# EAGLE design usb-isolator (EAGLE 7.7.0)
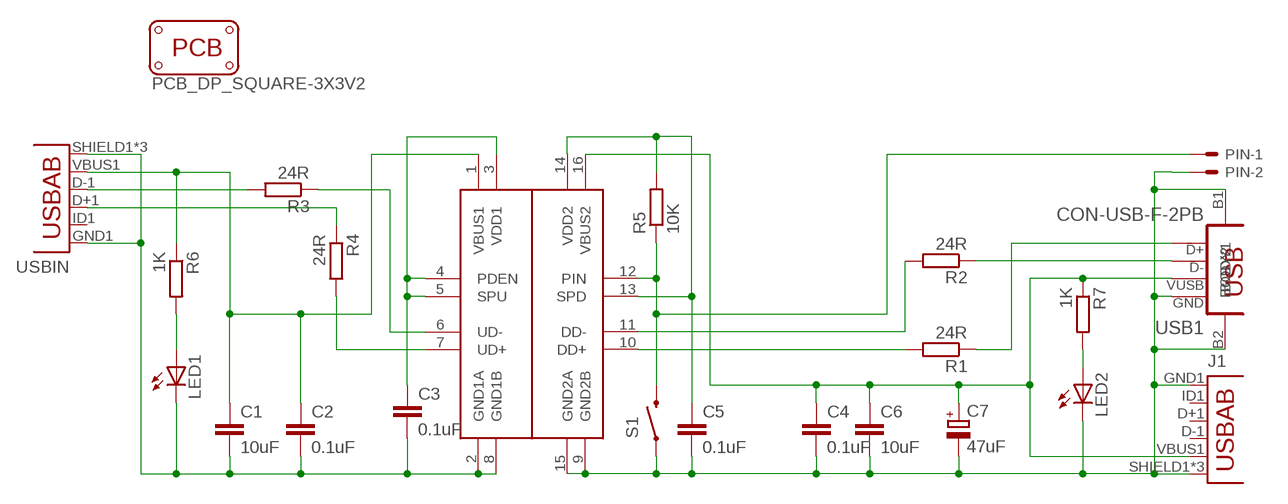
[diagram p0: schematic, sheet 1]

## Parts
C1  10uF  C-EUC0805K  [C0805K]
C2  0.1uF  C-EUC0603K  [C0603K]
C3  0.1uF  C-EUC0603K  [C0603K]
C4  0.1uF  C-EUC0603K  [C0603K]
C5  0.1uF  C-EUC0603K  [C0603K]
C6  10uF  C-EUC0805K  [C0805K]
C7  47uF  CPOL-EUD/7343-31W  [D/7343-31W]
IC1  ADUM3160BRWZ  [SO16W]
J1  USB-ABCONN-11794  [USB-AB-MICRO-SMD_V03]
LED1  LED-0805  [LED-805]
LED2  LED-0805  [LED-805]
PIN  22-23-2021  [22-23-2021]
R1  24R  R-EU_R0603  [R0603]
R2  24R  R-EU_R0603  [R0603]
R3  24R  R-EU_R0603  [R0603]
R4  24R  R-EU_R0603  [R0603]
R5  10K  R-EU_R0603  [R0603]
R6  1K  R-EU_R0603  [R0603]
R7  1K  R-EU_R0603  [R0603]
S1  SWITCH-MOMENTARY-2SMD-1101NE  [TACTILE-SWITCH-1101NE]
USB1  CON-USB-F-2PB  [CONN_USB_A_F]
USB-ISOLATOR  PCB_DP_SQUARE-3X3V2  [DP3030_V2]
USBIN  USB-ABCONN-11794  [USB-AB-MICRO-SMD_V03]

## Nets
DD_N [differential]: R2.1 USB1.2(D-)
DD_P [differential]: R1.1 USB1.3(D+)
GND1: C1.2 C2.2 C3.2 IC1.2(GND1A) IC1.8(GND1B) LED1.C USBIN.GND1(GND) USBIN.SHIELD1(SHIELD) USBIN.SHIELD2(SHIELD) USBIN.SHIELD3(SHIELD)
GND2: C4.2 C5.2 C6.2 C7.- IC1.9(GND2B) IC1.15(GND2A) J1.GND1(GND) J1.SHIELD1(SHIELD) J1.SHIELD2(SHIELD) J1.SHIELD3(SHIELD) LED2.C PIN.2 S1.1 USB1.4(GND) USB1.B1(BODY1) USB1.B2(BODY2)
N$12: LED1.A R6.2
N$13: LED2.A R7.2
PIN: IC1.12(PIN) PIN.1 R5.1 S1.2
R_DD_N [differential]: IC1.11(DD-) R2.2
R_DD_P [differential]: IC1.10(DD+) R1.2
R_UD_N [differential]: IC1.6(UD-) R3.1
R_UD_P [differential]: IC1.7(UD+) R4.2
UD_N [differential]: R4.1 USBIN.D+1(D+)
UD_P [differential]: R3.2 USBIN.D-1(D-)
VBUS1: C1.1 C2.1 IC1.1(VBUS1) R6.1 USBIN.VBUS1(VBUS)
VBUS2: C4.1 C6.1 C7.+ IC1.16(VBUS2) J1.VBUS1(VBUS) R7.1 USB1.1(VUSB)
VDD1: C3.1 IC1.3(VDD1) IC1.4(PDEN) IC1.5(SPU)
VDD2: C5.1 IC1.13(SPD) IC1.14(VDD2) R5.2
Unconnected: J1.D+1(D+) J1.D-1(D-) J1.ID1(USBID) USBIN.ID1(USBID)

## Library data of the parts
C1-C6 = rcl:C-EU: CAPACITOR, European symbol
C7 = rcl:CPOL-EU: POLARIZED CAPACITOR, European symbol
IC1 = semiconductors:ADUM3160
J1 USBIN = SparkFun-Connectors:USB-AB: This is a USB AB connector that is compatible with USB OTG. i.e. this connector can serve as a host or device; PROD_ID: CONN-11794
LED1 LED2 = semiconductors:LED: Light Emitting Diode
PIN = con-molex:22-23-2021: .100" (2.54mm) Center Header - 2 Pin; MF: MOLEX; MPN: 22-23-2021; OC_FARNELL: 1462926; OC_NEWARK: 25C3832
R1-R7 = resistor:R-EU_: RESISTOR, European symbol
S1 = SparkFun-Electromechanical:SWITCH-MOMENTARY-2: Various NO switches- pushbuttons, reed, etc; PROD_ID: SWCH-00815
USB1 = mechanical:CON-USB-F-2PB: USB Female connector with 2 body pins
USB-ISOLATOR = mechanical:PCB_DP_SQUARE: Dangerous Prototypes Standard Square PCB sizes (5050 is 49.9x49.9 for panelisation)

## Net classes
1 differential: width 0.25 mm, drill 0.305 mm, clearance 0.25 mm
2 isolated: width 0.25 mm, clearance 1 mm

## Board
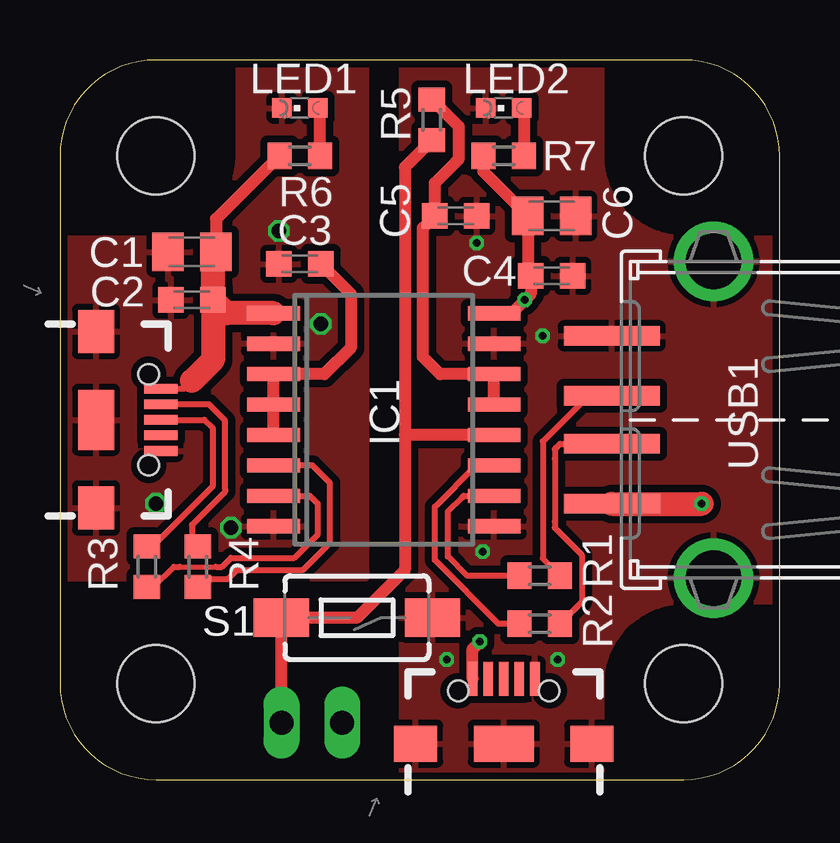
[diagram p1: board, top side]
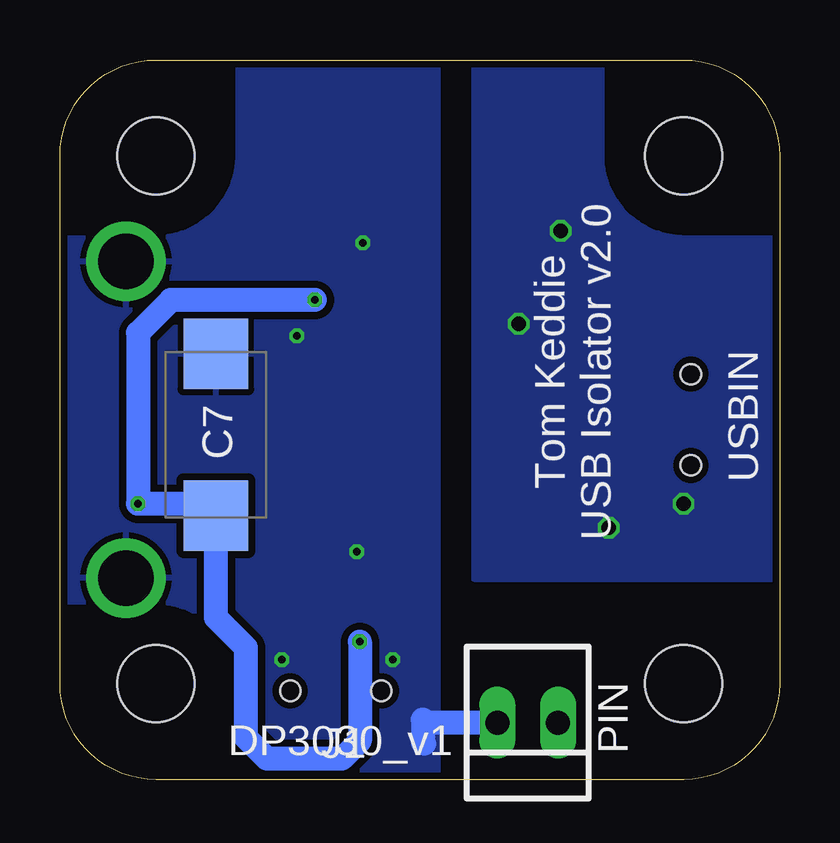
[diagram p2: board, bottom side, seen from below]

Size 30 x 30 mm. Coordinates in mm from the lower left corner, seen from the top.
Copper layers (1*16): Top 0.035mm / dielectric 1.5mm / Bottom 0.035mm
Design rules "ITEADstudio_DRC": minimum track width 6mil, minimum drill 12mil, track to track 6mil, track to pad 6mil, pad to pad 6mil, via to via 6mil, smd to smd 0mil, copper to edge 10mil, drill to drill 10mil, minimum pad ring 10mil, minimum via ring 6mil, stop-mask expansion 2mil, vias tented up to drill 100mil, thermal gap 10mil

### Footprints (pad centres in the part's own frame; a part is rotated, then mirrored left to right if it is on the bottom)
C0805K = smd 1.3 x 1.6: 1 -1,0; 2 1,0
C0603K = smd 1.05 x 1.08: 1 -0.875,0; 2 0.875,0
D/7343-31W = smd 2.95 x 2.7: + 3.375,0; - -3.375,0
SO16W = smd 0.6 x 2.2: 1 -4.445,-4.6; 2 -3.175,-4.6; 3 -1.905,-4.6; 4 -0.635,-4.6; 5 0.635,-4.6; 6 1.905,-4.6; 7 3.175,-4.6; 8 4.445,-4.6; 9 4.445,4.6; 10 3.175,4.6; 11 1.905,4.6; 12 0.635,4.6; 13 -0.635,4.6; 14 -1.905,4.6; 15 -3.175,4.6; 16 -4.445,4.6
USB-AB-MICRO-SMD_V03 = smd 1.4 x 0.4: D+1 2.7,0; D-1 2.7,0.65; GND1 2.7,-1.3; ID1 2.7,-0.65; VBUS1 2.7,1.3 | smd 1.5 x 1.8: SHIELD1 0,3.68; SHIELD3 0,-3.68 | smd 1.5 x 2.5: SHIELD2 0,0 | hole 0.85: 2.2,1.9; 2.2,-1.9
LED-603 = smd 0.8 x 0.8: A 0,-0.75; C 0,0.75
22-23-2021 = drill 1 long: 1 -1.27,0; 2 1.27,0
R0603 = smd 1 x 1.1: 1 -0.85,0; 2 0.85,0
TACTILE-SWITCH-1101NE = smd 2.3 x 1.6: 1 -3.15,0; 2 3.15,0
CONN_USB_A_F = smd 0.8 x 4: 1 -3.5,7; 2 -1,7; 3 1,7; 4 3.5,7 | drill 2.3: B1 -6.6,2.75; B2 6.6,2.75
DP3030_V1 = hole 3.2: 4,4; 26,4; 26,26; 4,26

### Placement (x,y rotation side)
C1  5.5,22 180 top
C2  5.5,20 180 top
C3  10,21.5 180 top
C4  20.5,21 0 top
C5  16.5,23.5 0 top
C6  20.5,23.5 0 top
C7  23.5,14.38 270 bottom
IC1  13.5,15 270 top
J1  18.5,1.5 90 top
LED1  [LED-603]  10,28 90 top
LED2  [LED-603]  18.5,28 90 top
PIN  10.5,2.38 180 bottom
R1  20,8.5 180 top
R2  20,6.5 180 top
R3  5.75,8.88 90 top
R4  3.62,8.88 270 top
R5  15.5,27.5 90 top
R6  10,26 0 top
R7  18.5,26 0 top
S1  12.38,6.75 180 top
USB1  30,15 90 top
USB-ISOLATOR  PCB_DP_SQUARE-3X3  [DP3030_V1]  0,0 0 top
USBIN  1.5,15 0 top

### Tracks (layer width: path | path; a pad name or v marks a point on that pad's centre or on a via)
DD_N
  Top 0.25: R2.1 21.75,7.4 21.75,9.38 20.62,10.5 20.62,10.75 20.62,13.38 20.62,13.77 20.68,13.82 20.85,14 USB1.2
DD_P
  Top 0.25: R1.1 20.12,9.22 20.12,14.1 22.02,16 USB1.3
GND1  (via drill 0.6)
  other vias: 4,11.5 7.12,10.5 10.88,19 9.12,22.88
  pour Top (isolate 0.305): 0,30 12.75,30 12.75,8.38 0,8.38
  pour Bottom (isolate 0.305): 0,30 12.75,30 12.75,8.38 0.12,8.38
GND2  (via drill 0.3)
  Bottom 1: PIN.2 14.75,2.38 14.88,2.5 14.88,1.55 J1.SHIELD1
  other vias: 17.62,9.5 20.75,5 16.12,5 20.12,18.5 17.38,22.38
  pour Top (isolate 0.305): 14.25,30 30,30 30,0 14.25,0
  pour Bottom (isolate 0.305): 14.25,30 30,30 30,0 14.25,0
N$12
  Top 0.5: R6.2 10.85,27.9 LED1.A
N$13
  Top 0.5: LED2.A 19.35,27.9 R7.2
PIN
  Top 0.5: R5.1 14.38,25.52 14.38,14.38 | 14.38,14.38 14.38,8.75 12.38,6.75 S1.2 9.23,6.5 PIN.1 | IC1.12 14.38,14.38
R_DD_N
  Top 0.25: R2.2 18.27,6.5 15.62,9.15 15.62,11.38 17.34,13.1 IC1.11
R_DD_P
  Top 0.25: R1.2 16.98,8.5 16.18,9.3 16.18,11.18 16.75,11.75 16.82,11.82 IC1.10
R_UD_N
  Top 0.25: R3.1 5.78,8.03 6.12,8.38 7,8.38 7.38,8.75 10.12,8.75 11.25,9.88 11.25,12.38 10.53,13.1 IC1.6
R_UD_P
  Top 0.2: 5,8.88 6.5,8.88
  Top 0.25: R4.2 3.9,8.03 4.75,8.88 5,8.88 | 6.5,8.88 6.75,8.88 7.12,9.25 9.77,9.25 10.75,10.23 10.75,11.5 10.43,11.82 IC1.7
UD_N
  Top 0.25: USBIN.D+1 6.02,15 6.38,14.65 6.38,12.25 3.88,9.75 3.65,9.75 R4.1
UD_P
  Top 0.25: USBIN.D-1 6.2,15.65 6.88,14.98 6.88,12.12 6.88,12 5.5,10.62 5.5,9.85 R3.2
VBUS1
  Top 0.25: USBIN.VBUS1 5.17,16.3 5.5,16.62
  Top 0.5: R6.1 9.12,26 6.5,23.38 C1.1
  Top 1: IC1.1 6.93,19.45 C2.1 | C2.1 6.38,17.5 5.5,16.62 | C2.1 6.38,21.88 C1.1
VBUS2  (via drill 0.3)
  Top 0.5: R7.1 17.65,25.35 C6.1 19.5,21.12 C4.1 19.62,20.25 v19.38,20 18.88,19.5 18.16,19.5 IC1.16 | J1.VBUS1 17.2,5.45 v17.5,5.75
  Top 1: USB1.1 v26.75,11.5
  Bottom 1: v17.5,5.75 17.5,1.62 18.25,0.88 21.38,0.88 22.25,1.75 22.25,5.5 23.5,6.75 C7.+ 24,11.5 v26.75,11.5 26.75,18.62 25.38,20 v19.38,20
VDD1
  Top 0.5: IC1.5 IC1.4 IC1.3 11.03,16.91 12.12,18 12.12,20.25 C3.1
VDD2
  Top 0.5: IC1.13 IC1.14 15.85,16.91 15.12,17.62 15.12,23 C5.1 15.62,24.88 16.5,25.75 16.62,25.88 16.62,27.23 R5.2

### Text on the board
bPlace: Tom Keddie / USB Isolator v2.0